# Altium schematic sheet Processing interface (Main).SchDoc: Processing interface
size A4; Author: Maxime Tousignant-Tremblay; Revision: 1; SheetNumber: 2; SheetTotal: 6
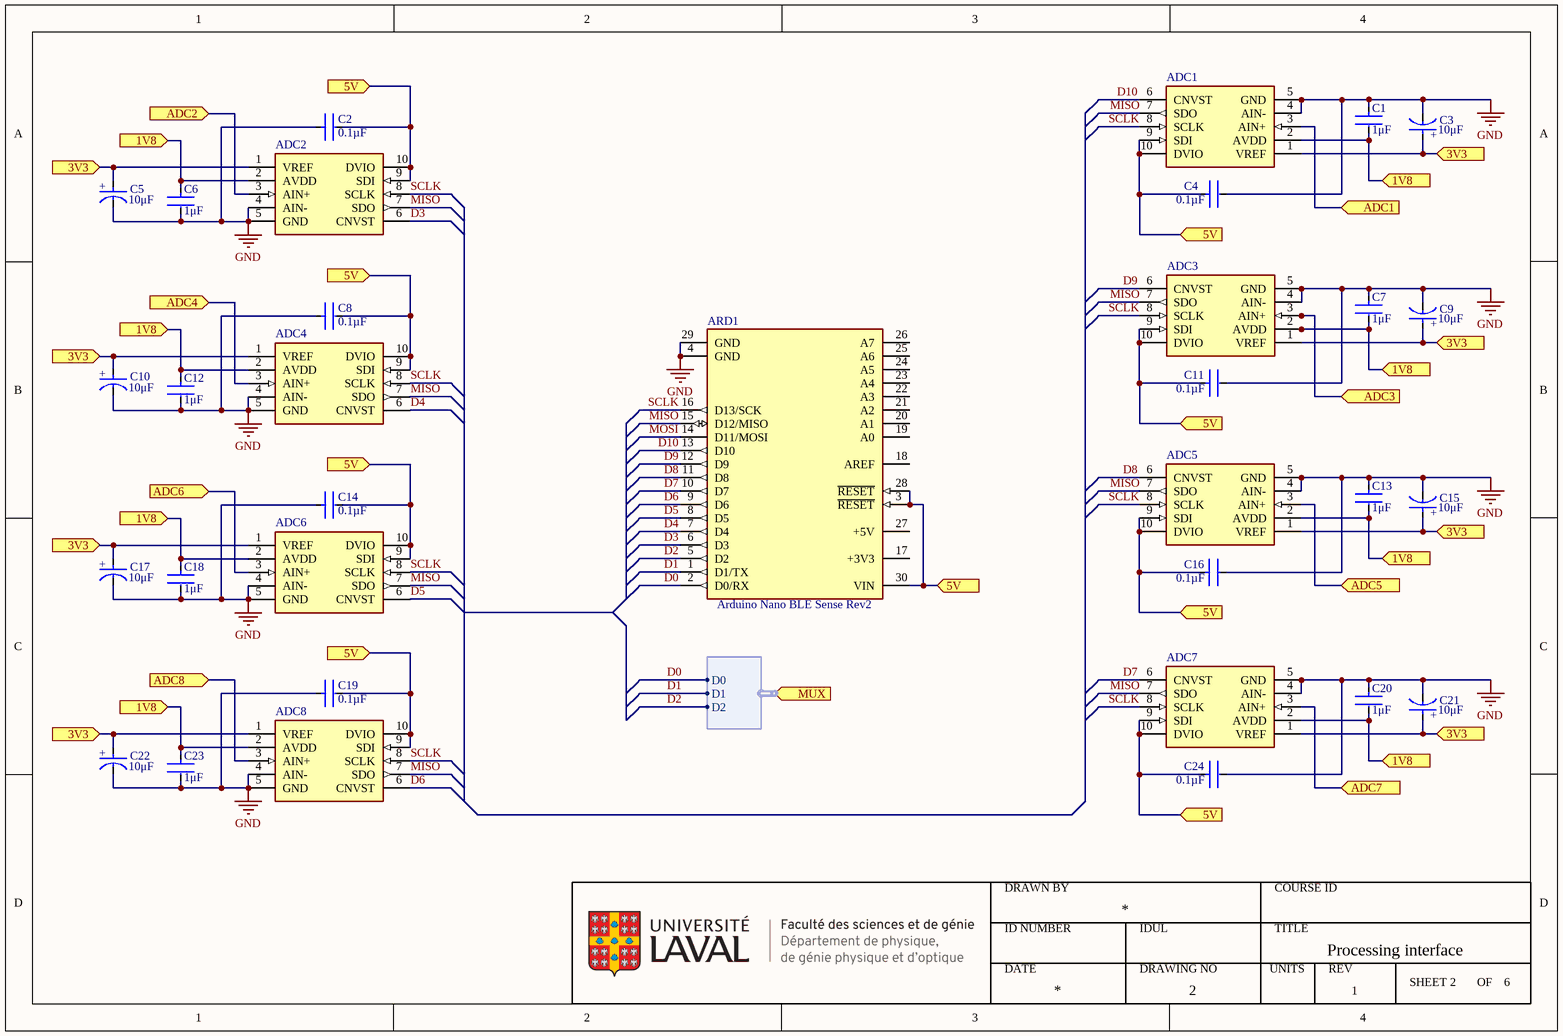
[diagram p0: Processing interface (Main).SchDoc]

## Parts
ADC1  MCP33141-10-E/MS  [MCP33141-10-E/MS]  (value not drawn)
ADC2  MCP33141-10-E/MS  [MCP33141-10-E/MS]  (value not drawn)
ADC3  MCP33141-10-E/MS  [MCP33141-10-E/MS]  (value not drawn)
ADC4  MCP33141-10-E/MS  [MCP33141-10-E/MS]  (value not drawn)
ADC5  MCP33141-10-E/MS  [MCP33141-10-E/MS]  (value not drawn)
ADC6  MCP33141-10-E/MS  [MCP33141-10-E/MS]  (value not drawn)
ADC7  MCP33141-10-E/MS  [MCP33141-10-E/MS]  (value not drawn)
ADC8  MCP33141-10-E/MS  [MCP33141-10-E/MS]  (value not drawn)
ARD1  Arduino Nano BLE Sense Rev2  [Arduino Nano BLE Sense Rev2 A]
C1  value 1μF  [CC0603KPX7R7BB105]  (hidden comment: CC0603KPX7R7BB105)
C2  Capacitance: 0.1µF  [CC0603JRX7R9BB104]
C3  value 10μF  [293D106X9016B2TE3]  (hidden comment: 293D106X9016B2TE3)
C4  Capacitance: 0.1µF  [CC0603JRX7R9BB104]
C5  value 10μF  [293D106X9016B2TE3]  (hidden comment: 293D106X9016B2TE3)
C6  value 1μF  [CC0603KPX7R7BB105]  (hidden comment: CC0603KPX7R7BB105)
C7  value 1μF  [CC0603KPX7R7BB105]  (hidden comment: CC0603KPX7R7BB105)
C8  Capacitance: 0.1µF  [CC0603JRX7R9BB104]
C9  value 10μF  [293D106X9016B2TE3]  (hidden comment: 293D106X9016B2TE3)
C10  value 10μF  [293D106X9016B2TE3]  (hidden comment: 293D106X9016B2TE3)
C11  Capacitance: 0.1µF  [CC0603JRX7R9BB104]
C12  value 1μF  [CC0603KPX7R7BB105]  (hidden comment: CC0603KPX7R7BB105)
C13  value 1μF  [CC0603KPX7R7BB105]  (hidden comment: CC0603KPX7R7BB105)
C14  Capacitance: 0.1µF  [CC0603JRX7R9BB104]
C15  value 10μF  [293D106X9016B2TE3]  (hidden comment: 293D106X9016B2TE3)
C16  Capacitance: 0.1µF  [CC0603JRX7R9BB104]
C17  value 10μF  [293D106X9016B2TE3]  (hidden comment: 293D106X9016B2TE3)
C18  value 1μF  [CC0603KPX7R7BB105]  (hidden comment: CC0603KPX7R7BB105)
C19  Capacitance: 0.1µF  [CC0603JRX7R9BB104]  (hidden comment: CC0603JRX7R9BB104)
C20  value 1μF  [CC0603KPX7R7BB105]  (hidden comment: CC0603KPX7R7BB105)
C21  value 10μF  [293D106X9016B2TE3]  (hidden comment: 293D106X9016B2TE3)
C22  value 10μF  [293D106X9016B2TE3]  (hidden comment: 293D106X9016B2TE3)
C23  value 1μF  [CC0603KPX7R7BB105]  (hidden comment: CC0603KPX7R7BB105)
C24  Capacitance: 0.1µF  [CC0603JRX7R9BB104]

## Ports
1V8 (in), 3V3 (in), 5V (in), ADC1 (in), ADC2 (in), ADC3 (in), ADC4 (in), ADC5 (in), ADC6 (in), ADC7 (in), ADC8 (in), MUX (in, harness *)

## Harnesses
*: D0, D1, D2

## Nets
GND: ADC1.4(AIN-) ADC1.5(GND) ADC2.4(AIN-) ADC2.5(GND) ADC3.4(AIN-) ADC3.5(GND) ADC4.4(AIN-) ADC4.5(GND) ADC5.4(AIN-) ADC5.5(GND) ADC6.4(AIN-) ADC6.5(GND) ADC7.4(AIN-) ADC7.5(GND) ADC8.4(AIN-) ADC8.5(GND) ARD1.4(GND) ARD1.29(GND) C1.1 C2.1 C3.1(C) C4.2 C5.1(C) C6.2 C7.1 C8.1 C9.1(C) C10.1(C) C11.2 C12.2 C13.1 C14.1 C15.1(C) C16.2 C17.1(C) C18.2 C19.1 C20.1 C21.1(C) C22.1(C) C23.2 C24.2
1V8: ADC1.2(AVDD) ADC2.2(AVDD) ADC3.2(AVDD) ADC4.2(AVDD) ADC5.2(AVDD) ADC6.2(AVDD) ADC7.2(AVDD) ADC8.2(AVDD) C1.2 C6.1 C7.2 C12.1 C13.2 C18.1 C20.2 C23.1 ; port 1V8
3V3: ADC1.1(VREF) ADC2.1(VREF) ADC3.1(VREF) ADC4.1(VREF) ADC5.1(VREF) ADC6.1(VREF) ADC7.1(VREF) ADC8.1(VREF) C3.2(A) C5.2(A) C9.2(A) C10.2(A) C15.2(A) C17.2(A) C21.2(A) C22.2(A) ; port 3V3
5V: ADC1.9(SDI) ADC1.10(DVIO) ADC2.9(SDI) ADC2.10(DVIO) ADC3.9(SDI) ADC3.10(DVIO) ADC4.9(SDI) ADC4.10(DVIO) ADC5.9(SDI) ADC5.10(DVIO) ADC6.9(SDI) ADC6.10(DVIO) ADC7.9(SDI) ADC7.10(DVIO) ADC8.9(SDI) ADC8.10(DVIO) ARD1.3(~{RESET}) ARD1.28(~{RESET}) ARD1.30(VIN) C2.2 C4.1 C8.2 C11.1 C14.2 C16.1 C19.2 C24.1 ; port 5V
ADC1: ADC1.3(AIN+) ; port ADC1
ADC2: ADC2.3(AIN+) ; port ADC2
ADC3: ADC3.3(AIN+) ; port ADC3
ADC4: ADC4.3(AIN+) ; port ADC4
ADC5: ADC5.3(AIN+) ; port ADC5
ADC6: ADC6.3(AIN+) ; port ADC6
ADC7: ADC7.3(AIN+) ; port ADC7
ADC8: ADC8.3(AIN+) ; port ADC8
D0: ARD1.2(D0/RX) ; port MUX.D0
D1: ARD1.1(D1/TX) ; port MUX.D1
D2: ARD1.5(D2) ; port MUX.D2
D3: ADC2.6(CNVST) ARD1.6(D3)
D4: ADC4.6(CNVST) ARD1.7(D4)
D5: ADC6.6(CNVST) ARD1.8(D5)
D6: ADC8.6(CNVST) ARD1.9(D6)
D7: ADC7.6(CNVST) ARD1.10(D7)
D8: ADC5.6(CNVST) ARD1.11(D8)
D9: ADC3.6(CNVST) ARD1.12(D9)
D10: ADC1.6(CNVST) ARD1.13(D10)
MISO: ADC1.7(SDO) ADC2.7(SDO) ADC3.7(SDO) ADC4.7(SDO) ADC5.7(SDO) ADC6.7(SDO) ADC7.7(SDO) ADC8.7(SDO) ARD1.15(D12/MISO)
MOSI: ARD1.14(D11/MOSI)
SCLK: ADC1.8(SCLK) ADC2.8(SCLK) ADC3.8(SCLK) ADC4.8(SCLK) ADC5.8(SCLK) ADC6.8(SCLK) ADC7.8(SCLK) ADC8.8(SCLK) ARD1.16(D13/SCK)

Not connected (* = marked no-connect by the designer): ARD1 17(+3V3) 18(AREF) 19(A0) 20(A1) 21(A2) 22(A3) 23(A4) 24(A5) 25(A6) 26(A7) 27(+5V)

## Notes on the sheet
- DRAWN BY
- COURSE ID
- ID NUMBER
- DATE
- IDUL
- DRAWING NO
- TITLE
- UNITS
- REV
- SHEET
- OF
- (in symbol 293D106X9016B2TE3) +

## Library data of the parts
ADC1-ADC8 = MCP33141-10-E/MS: 12 Bit Analog to Digital Converter 1 Input 1 SAR 10-MSOP; Supplier 1: Digi-Key; Supplier Part Number 1: MCP33141-10-E/MS-ND
ARD1 = Arduino Nano BLE Sense Rev2: ABX00069, nRF52840 64MHz, 256 KB SRAM, 1MB flash, 14 I/O pins, 8 Analog inputs; Supplier 1: Digi-Key; Supplier Part Number 1: 1050-ABX00069-ND; ComponentLink1Description: Datasheet; ComponentLink1URL: https://docs.arduino.cc/static/65becb67a4b40fb616bb6af2730da4c7/ABX00069-datasheet.pdf; ComponentLink2Description: Pinout; ComponentLink2URL: https://docs.arduino.cc/static/9954a74bd83e85753daa710cb3e36c7d/ABX00069-full-pinout.pdf; ComponentLink3Description: Schematics; ComponentLink3URL: https://docs.arduino.cc/static/e36f3575dfede10661305c9971c3e7ed/ABX00069-schematics.pdf
C1 C6 C7 C12 C13 C18 C20 C23 = CC0603KPX7R7BB105: 1 µF ±10% 16V Ceramic Capacitor X7R 0603 (1608 Metric); Dielectric: XR7; Tolerance: 10%; Max Operating Temperature: 125°C; Case Code (Imperial): 0603; Voltage Rating (DC): 16V; Resistor Type: Ceramic; Height: 0.8mm; Length: 1.6mm; Construction: Flat; Termination: SMT/SMD; Min Operating Temperature: -55°C; Supplier 1: Digi-Key; Supplier Part Number 1: 13-CC0603KPX7R7BB105CT-ND; Supplier 2: Digi-Key; Supplier Part Number 2: 13-CC0603KPX7R7BB105DKR-ND; Supplier 3: Digi-Key; Supplier Part Number 3: 13-CC0603KPX7R7BB105TR-ND
C2 C4 C8 C11 C14 C16 C19 C24 = CC0603JRX7R9BB104: 0.1 µF ±5% 50V Ceramic Capacitor X7R 0603 (1608 Metric); manufacturer: Yageo; Part Number: CC0603JRX7R9BB104; Applications: General Purpose; componentlink1description: Datasheet; componentlink1url: https://www.yageo.com/upload/media/product/productsearch/datasheet/mlcc/UPY-GPHC_X7R_6.3V-to-50V_18.pdf; componentlink2description: DigiKey Link; componentlink2url: https://www.digikey.com/en/products/detail/yageo/CC0603JRX7R9BB104/5195188; Device Package: 0603 (1608 Metric); lastupdated: 2023-03-06 20:08:09; Lifecycle Status: Active; Minimum Order: 1; Mounting Type: Surface Mount, MLCC; Operating Temperature: -55°C ~ 125°C; Package / Case: 0603 (1608 Metric); packaging: TapeAndReel; partid: 12474; Part Status: Active; price: 0.01; series: CC; Size / Dimension: 0.063" L x 0.031" W (1.60mm x 0.80mm); Temperature Coefficient: X7R; Thickness (Max): 0.035" (0.90mm); Tolerance: ±5%; Voltage - Rated: 50V; Supplier 1: Digi-Key; Supplier Part Number 1: 311-1779-1-ND; Supplier 2: Digi-Key; Supplier Part Number 2: 311-1779-6-ND; Supplier 3: Digi-Key; Supplier Part Number 3: 311-1779-2-ND
C3 C5 C9 C10 C15 C17 C21 C22 = 293D106X9016B2TE3: 10 µF Molded Tantalum Capacitors 16 V 1411 (3528 Metric) 2Ohm; Voltage Rating: 16V; Case Code (Imperial): 1411; Supplier 1: Digi-Key; Supplier Part Number 1: 718-1124-1-ND; Supplier 2: Digi-Key; Supplier Part Number 2: 718-1124-6-ND; Supplier 3: Digi-Key; Supplier Part Number 3: 718-1124-2-ND